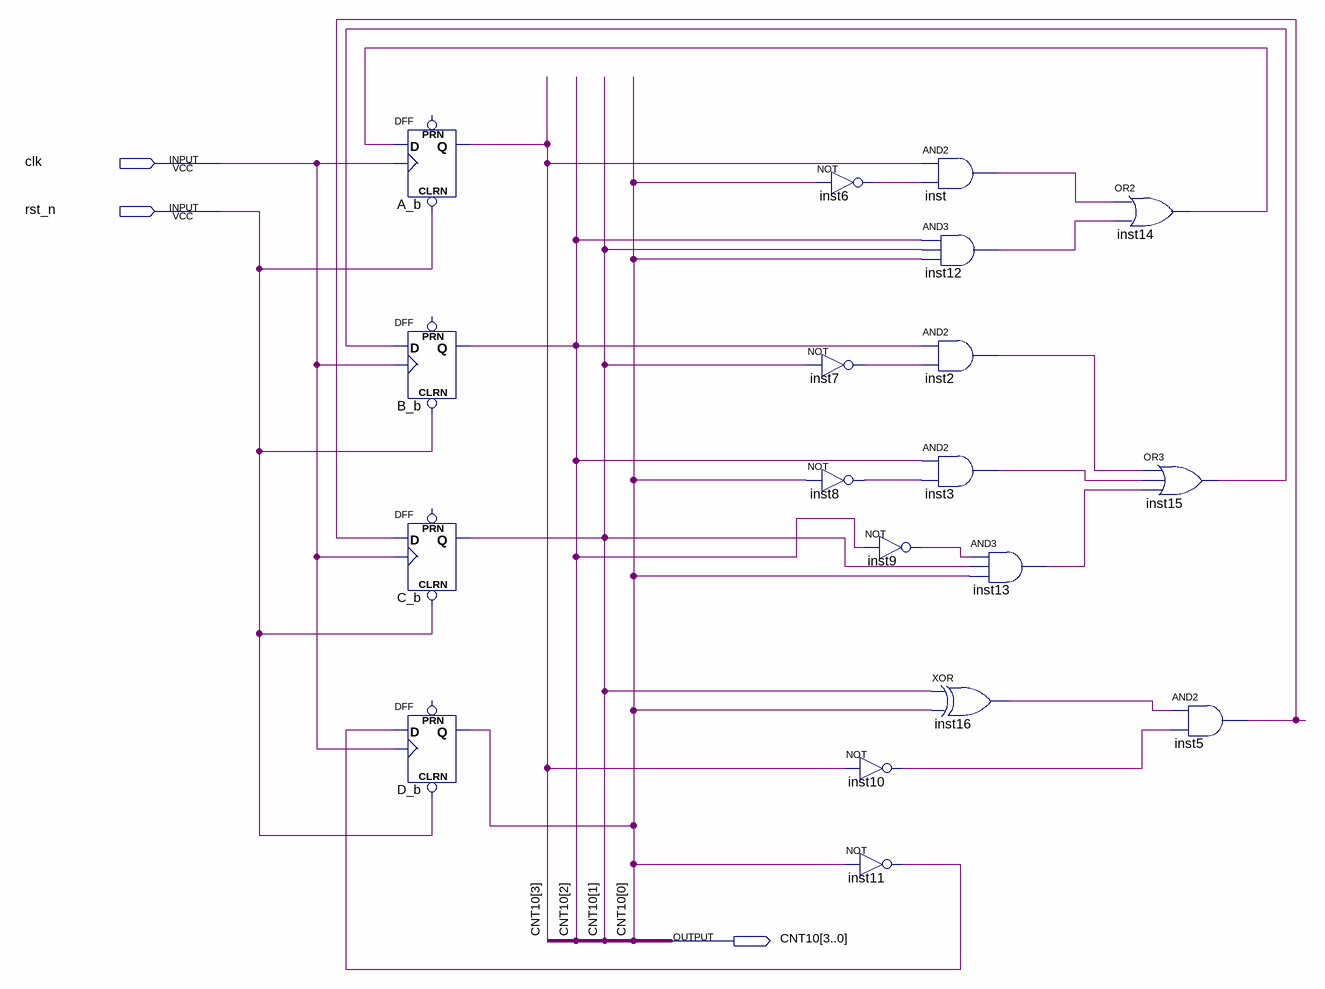
[diagram p0: schematic sheet]
// Quartus schematic counter10.bdf as structural Verilog: 19 symbols, 3 pins
module counter10 (
  input  clk,
  input  rst_n,
  output [3:0] CNT10
);

  wire inst2_out, inst3_out, inst5_out, inst6_out, inst7_out, inst8_out, inst9_out, inst10_out, inst11_out,
       inst12_out, inst13_out, inst14_out, inst15_out, inst16_out, inst_out;

  DFF A_b (.CLRN(rst_n), .CLK(clk), .D(inst14_out), .Q(CNT10[3]));  // open: PRN
  DFF B_b (.CLRN(rst_n), .CLK(clk), .D(inst15_out), .Q(CNT10[2]));  // open: PRN
  DFF C_b (.CLRN(rst_n), .CLK(clk), .D(inst5_out), .Q(CNT10[1]));  // open: PRN
  DFF D_b (.CLRN(rst_n), .CLK(clk), .D(inst11_out), .Q(CNT10[0]));  // open: PRN
  not inst6 (inst6_out, CNT10[0]);
  not inst7 (inst7_out, CNT10[1]);
  not inst8 (inst8_out, CNT10[0]);
  not inst10 (inst10_out, CNT10[3]);
  not inst11 (inst11_out, CNT10[0]);
  and inst (inst_out, CNT10[3], inst6_out);
  and inst12 (inst12_out, CNT10[2], CNT10[1], CNT10[0]);
  and inst2 (inst2_out, CNT10[2], inst7_out);
  and inst3 (inst3_out, CNT10[2], inst8_out);
  not inst9 (inst9_out, CNT10[2]);
  xor inst16 (inst16_out, CNT10[1], CNT10[0]);
  and inst13 (inst13_out, inst9_out, CNT10[1], CNT10[0]);
  or inst14 (inst14_out, inst_out, inst12_out);
  or inst15 (inst15_out, inst2_out, inst3_out, inst13_out);
  and inst5 (inst5_out, inst16_out, inst10_out);
endmodule
